# EAGLE design SpeakerPCB (EAGLE 9.6.2)
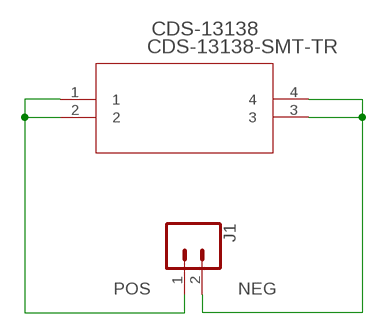
[diagram p0: schematic, sheet 1]

## Parts
CDS-13138  CDS-13138-SMT-TR  [CHIP_SMT-TR]
J1  CONN_02  [1X02]

## Nets
NEG: CDS-13138.3 CDS-13138.4 J1.2
POS: CDS-13138.1 CDS-13138.2 J1.1

## Library data of the parts
CDS-13138 = CUISpeaker:CDS-13138-SMT-TR; COPYRIGHT: Copyright (C) 2021 Ultra Librarian. All rights reserved.; DIGI-KEY_PART_NUMBER_1: 102-3536-1-ND; DIGI-KEY_PART_NUMBER_2: 102-3536-2-ND; DIGI-KEY_PART_NUMBER_3: 102-3536-6-ND; MANUFACTURER_PART_NUMBER: CDS-13138-SMT-TR; MFR_NAME: CUI Inc
J1 = SparkFun-Connectors:CONN_02: Multi connection point. Often used as Generic Header-pin footprint for 0.1 inch spaced/style header connections On any of the 0.1 inch spaced packages, you can populate with these: Break Away Headers - Straight <https://www.sparkfun.com/products/116> (PRT-00116) Break Away Male Headers - Right Angle <https://www.sparkfun.com/products/553> (PRT-00553) Female Headers <https://www.sparkfun.com/products/115> (PRT-00115) Break Away Headers - Machine Pin <https://www.sparkfun.com/products/117> (PRT-00117) Break Away Female Headers - Swiss Machine Pin <https://www.sparkfun.com/products/743> (PRT-00743) For SCREWTERMINALS and SPRING TERMINALS visit here: Screw Terimnals on SparkFun.com <https://www.sparkfun.com/search/results?term=Screw+Terminals> (5mm/3.5mm/2.54mm spacing) This device is also useful as a general connection point to wire up your design to another part of your project. Our various solder wires solder well into these plated through hole pads. Hook-Up Wire - Assortment (Stranded, 22 AWG) <https://www.sparkfun.com/products/11375> (PRT-11375) Hook-Up Wire - Assortment (Solid Core, 22 AWG) <https://www.sparkfun.com/products/11367> (PRT-11367) View the entire wire category on our website here <https://www.sparkfun.com/categories/141> Special notes: Molex polarized connector foot print use with: PRT-08233 with associated crimp pins and housings. 2.54_SCREWTERM for use with PRT-10571. 3.5mm Screw Terminal footprints for PRT-08084 5mm Screw Terminal footprints for use with PRT-08432

## Board
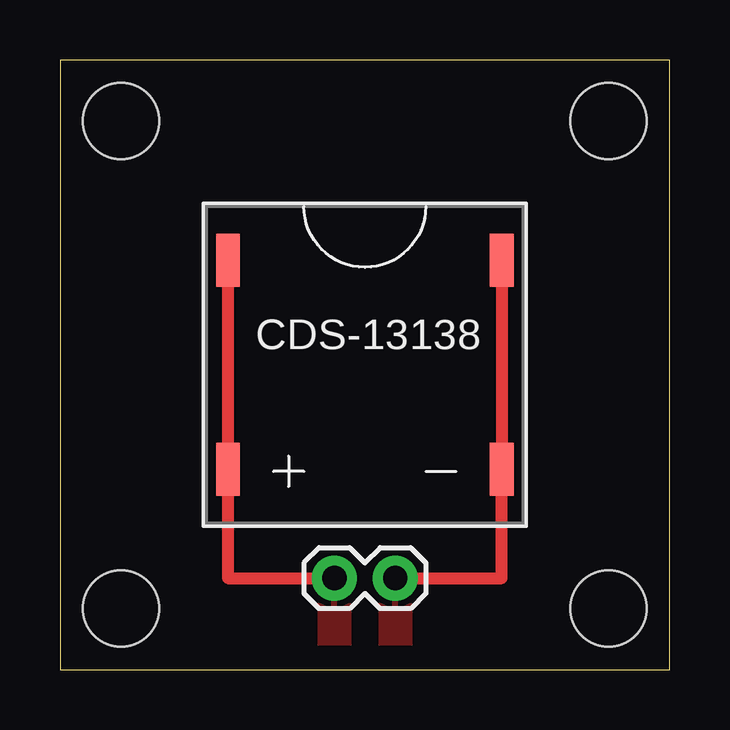
[diagram p1: board, top side]

Size 25.4 x 25.4 mm. Coordinates in mm from the lower left corner, seen from the top.
Outline: 0,0 25.4,0 25.4,25.4 0,25.4 0,0
Copper layers (1*16): Top 0.035mm / dielectric 1.5mm / Bottom 0.035mm
Design rules "default": minimum track width 6mil, minimum drill 0.35mm, track to track 6mil, track to pad 6mil, pad to pad 6mil, via to via 6mil, smd to smd 6mil, copper to edge 40mil, drill to drill 6mil, minimum pad ring 10mil, minimum via ring 8mil, stop-mask expansion 4mil, vias tented up to drill 0mil, thermal gap 10mil
Holes 3.17 mm at 2.54,22.86 2.54,2.54 22.86,2.54 22.86,22.86

### Footprints (pad centres in the part's own frame; a part is rotated, then mirrored left to right if it is on the bottom)
CHIP_SMT-TR = smd 0.991 x 2.21: 1 -5.702,4.35; 2 -5.702,-4.35; 3 5.702,-4.35; 4 5.702,4.35
1X02 = drill 1.016 pad 1.88: 1 0,0; 2 2.54,0

### Placement (x,y rotation side)
CDS-13138  12.7,12.7 0 top
J1  11.43,3.81 0 top

### Tracks (layer width: path | path; a pad name or v marks a point on that pad's centre or on a via)
NEG
  Top 0.508: CDS-13138.4 CDS-13138.3 18.4,3.81 J1.2
  pour Top: 14.61,3.81 14.61,0 13.34,0 13.34,3.81
POS
  Top 0.508: CDS-13138.1 CDS-13138.2 7,3.81 J1.1
  pour Top: 12.06,3.81 12.06,0 10.79,0 10.79,3.81